# Altium project waku-ctl-board.PrjPcb (part 2 of 5)
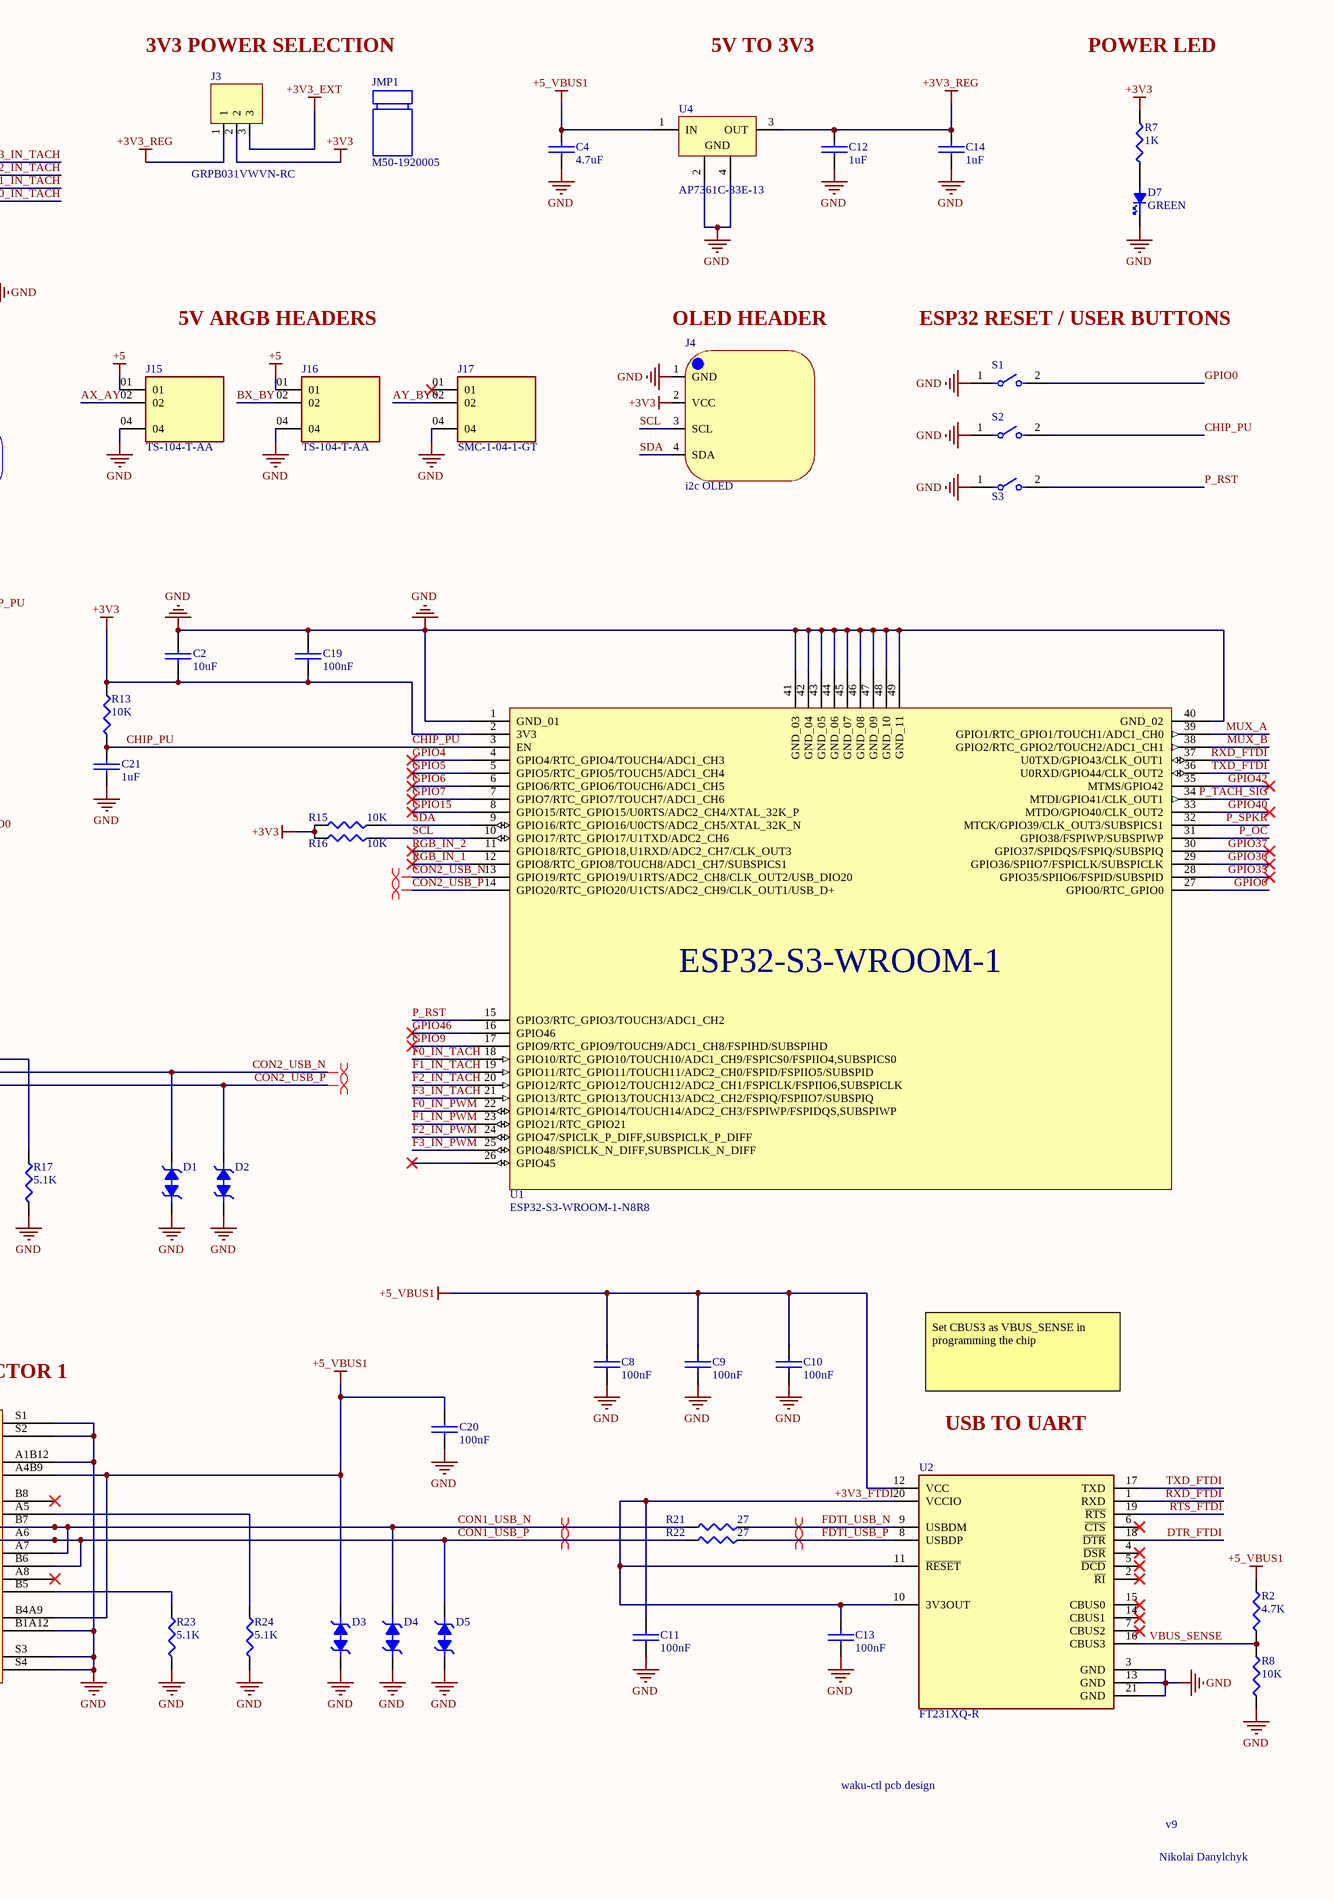
[diagram p2: waku-ctl.SchDoc, right]

## Sheet waku-ctl.SchDoc (continued)
### Library data of the parts
C1 C3 C5-C11 C13 C19 C20 = CL10B104KB8NNNC: CAP CER 0.1UF 50V X7R 0603; Manufacturer: Samsung Electro-Mechanics; Dielectric Material: Ceramic; Tolerance: 10%; Supplier: DigiKey; Supplier Part Number: 1276-1000-6-ND; Manufacturer Part Number: CL10B104KB8NNNC; RoHS: Compliant; Category: Ceramic Capacitors; Stock: 3849290; Pricing: 1=0.08, 10=0.004 (USD); Value: 100nF; Case/Package: 0603; Case Code (Imperial): 0603; Case Code (Metric): 1608; China RoHS: Compliant; Contact Plating: Tin; Depth: 800µm; Dielectric: X7R; Height: 900µm; Lead Free: Lead Free; Length: 1.6mm; Lifecycle Status: Production; Material: Ceramic; Max Operating Temperature: 125°C; Min Operating Temperature: -55°C; Mounting Technology: Surface Mount; Number of Terminals: 2; Radiation Hardening: No; REACH SVHC: Yes; Schedule B: 8532240020, 8532240020|8532240020|8532240020|8532240020|8532240020|8532240020|8532240020|8532240020|8532240020|8532240020, 8532240020|8532240020|8532240020|8532240020|8532240020|8532240020|8532240020|8532240020|8532240020|8532240020|8532240020, 8532240020|8532240020|8532240020|8532240020|8532240020|8532240020|8532240020|8532240020|8532240020|8532240020|8532240020|8532240020; Thickness: 889µm; Voltage: 50V; Voltage Rating: 50V; Voltage Rating (DC): 50V; Width: 800µm; ComponentLink1URL: https://datasheet.octopart.com:443/CL10B104KB8NNNC-Samsung-datasheet-165517828.pdf?src-supplier=Upverter; ComponentLink1Description: https://datasheet.octopart.com:443/CL10B104KB8NNNC-Samsung-datasheet-165517828.pdf?src-supplier=Upverter; ComponentLink2URL: https://datasheet.octopart.com:443/CL10B104KB8NNNC-Samsung-Electro-Mechanics-datasheet-116890969.pdf?src-supplier=Upverter; ComponentLink2Description: https://datasheet.octopart.com:443/CL10B104KB8NNNC-Samsung-Electro-Mechanics-datasheet-116890969.pdf?src-supplier=Upverter; ComponentLink3URL: https://datasheet.octopart.com:443/CL10B104KB8NNNC-Samsung-Electro-Mechanics-datasheet-81461840.pdf?src-supplier=Upverter; ComponentLink3Description: https://datasheet.octopart.com:443/CL10B104KB8NNNC-Samsung-Electro-Mechanics-datasheet-81461840.pdf?src-supplier=Upverter; ComponentLink4URL: https://datasheet.octopart.com:443/CL10B104KB8NNNC-Samsung-Electro-Mechanics-datasheet-181551448.pdf?src-supplier=Newark; ComponentLink4Description: https://datasheet.octopart.com:443/CL10B104KB8NNNC-Samsung-Electro-Mechanics-datasheet-181551448.pdf?src-supplier=Newark; ComponentLink5URL: https://datasheet.octopart.com:443/CL10B104KB8NNNC-Samsung-Electro-Mechanics-datasheet-181551449.pdf?src-supplier=Newark; ComponentLink5Description: https://datasheet.octopart.com:443/CL10B104KB8NNNC-Samsung-Electro-Mechanics-datasheet-181551449.pdf?src-supplier=Newark; ComponentLink6URL: https://datasheet.octopart.com/CL10B104KB8NNNC-Samsung-Electro-Mechanics-datasheet-8324245.pdf; ComponentLink6Description: https://datasheet.octopart.com/CL10B104KB8NNNC-Samsung-Electro-Mechanics-datasheet-8324245.pdf; ComponentLink7URL: https://datasheet.octopart.com/CL10B104KB8NNNC-Samsung-Electro-Mechanics-datasheet-97040617.pdf; ComponentLink7Description: https://datasheet.octopart.com/CL10B104KB8NNNC-Samsung-Electro-Mechanics-datasheet-97040617.pdf; ComponentLink8URL: https://datasheet.octopart.com/General-Multilayer-Ceramic-Capacitors-Samsung-datasheet-family-111.pdf; ComponentLink8Description: https://datasheet.octopart.com/General-Multilayer-Ceramic-Capacitors-Samsung-datasheet-family-111.pdf; ComponentLink9URL: https://datasheet.octopart.com:443/CL10B104KB8NNNC-Samsung-Electro-Mechanics-datasheet-136482302.pdf?src-supplier=Samsung+SCT; ComponentLink9Description: https://datasheet.octopart.com:443/CL10B104KB8NNNC-Samsung-Electro-Mechanics-datasheet-136482302.pdf?src-supplier=Samsung+SCT; ComponentLink10URL: https://datasheet.octopart.com:443/CL10B104KB8NNNC-Samsung-datasheet-42770373.pdf?src-supplier=Future+Electronics; ComponentLink10Description: https://datasheet.octopart.com:443/CL10B104KB8NNNC-Samsung-datasheet-42770373.pdf?src-supplier=Future+Electronics; ComponentLink11URL: https://datasheet.octopart.com:443/CL10B104KB8NNNC-Samsung-datasheet-26589154.pdf?src-supplier=Future+Electronics; ComponentLink11Description: https://datasheet.octopart.com:443/CL10B104KB8NNNC-Samsung-datasheet-26589154.pdf?src-supplier=Future+Electronics; ComponentLink12URL: https://datasheet.octopart.com:443/CL10B104KB8NNNC-Samsung-Electro-Mechanics-datasheet-149136784.pdf?src-supplier=Future+Electronics; ComponentLink12Description: https://datasheet.octopart.com:443/CL10B104KB8NNNC-Samsung-Electro-Mechanics-datasheet-149136784.pdf?src-supplier=Future+Electronics; ComponentLink13URL: https://datasheet.octopart.com:443/CL10B104KB8NNNC-Samsung-datasheet-22147433.pdf?src-supplier=TME; ComponentLink13Description: https://datasheet.octopart.com:443/CL10B104KB8NNNC-Samsung-datasheet-22147433.pdf?src-supplier=TME; ComponentLink14URL: https://datasheet.octopart.com:443/CL10B104KB8NNNC-Samsung-Electro-Mechanics-datasheet-11837008.pdf?src-supplier=Arrow+Electronics; ComponentLink14Description: https://datasheet.octopart.com:443/CL10B104KB8NNNC-Samsung-Electro-Mechanics-datasheet-11837008.pdf?src-supplier=Arrow+Electronics; ComponentLink15URL: http://sigma.octopart.com:80/rohs_certificate/General-Multilayer-Ceramic-Capacitors-Samsung-family-110.pdf?src-supplier=Compliance+Statements; ComponentLink15Description: http://sigma.octopart.com:80/rohs_certificate/General-Multilayer-Ceramic-Capacitors-Samsung-family-110.pdf?src-supplier=Compliance+Statements; ComponentLink16URL: http://sigma.octopart.com:80/rohs_statement/General-Multilayer-Ceramic-Capacitors-Samsung-family-132.pdf?src-supplier=Compliance+Statements; ComponentLink16Description: http://sigma.octopart.com:80/rohs_statement/General-Multilayer-Ceramic-Capacitors-Samsung-family-132.pdf?src-supplier=Compliance+Statements; ComponentLink17URL: http://sigma.octopart.com:80/reach_statement/General-Multilayer-Ceramic-Capacitors-Samsung-family-133.pdf?src-supplier=Compliance+Statements; ComponentLink17Description: http://sigma.octopart.com:80/reach_statement/General-Multilayer-Ceramic-Capacitors-Samsung-family-133.pdf?src-supplier=Compliance+Statements; LCSC Part Number: C1591
C2 = CL10A106KP8NNNC: CAP CER 10UF 10V X5R 0603; Manufacturer: Samsung Electro-Mechanics; Value: 10µF; Dielectric Material: Ceramic; Tolerance: 10%; Supplier: DigiKey; Supplier Part Number: 1276-1192-6-ND; Manufacturer Part Number: CL10A106KP8NNNC; RoHS: Compliant; Category: Ceramic Capacitors; Stock: 1052975; Pricing: 1=0.08, 10=0.022 (USD); Case/Package: 0603; Case Code (Imperial): 0603; Case Code (Metric): 1608; China RoHS: Compliant; Contact Plating: Tin; Depth: 800µm; Dielectric: X5R; Height: 800µm; Lead Free: Lead Free; Length: 1.6mm; Lifecycle Status: Production; Material: Ceramic; Max Operating Temperature: 85°C; Min Operating Temperature: -55°C; Mounting Technology: Surface Mount; Number of Terminals: 2; Radiation Hardening: No; REACH SVHC: Yes; Schedule B: 8532240020, 8532240020|8532240020|8532240020|8532240020|8532240020|8532240020|8532240020|8532240020|8532240020|8532240020|8532240020|8532240020|8532240020|8532240020|8532240020|8532240020|8532240020|8532240020|8532240020|8532240020|8532240020|8532240020|8532240020|85; Thickness: 889µm; Voltage Rating: 10V; Voltage Rating (DC): 10V; Width: 800µm; ComponentLink1URL: https://datasheet.octopart.com:443/CL10A106KP8NNNC-Samsung-Electro-Mechanics-datasheet-181960519.pdf?src-supplier=IHS; ComponentLink1Description: https://datasheet.octopart.com:443/CL10A106KP8NNNC-Samsung-Electro-Mechanics-datasheet-181960519.pdf?src-supplier=IHS; ComponentLink2URL: https://datasheet.octopart.com/CL10A106KP8NNNC-Samsung-Electro-Mechanics-datasheet-8324245.pdf; ComponentLink2Description: https://datasheet.octopart.com/CL10A106KP8NNNC-Samsung-Electro-Mechanics-datasheet-8324245.pdf; ComponentLink3URL: https://datasheet.octopart.com/CL10A106KP8NNNC-Samsung-Electro-Mechanics-datasheet-97040617.pdf; ComponentLink3Description: https://datasheet.octopart.com/CL10A106KP8NNNC-Samsung-Electro-Mechanics-datasheet-97040617.pdf; ComponentLink4URL: https://datasheet.octopart.com:443/CL10A106KP8NNNC-Samsung-Electro-Mechanics-datasheet-136031754.pdf?src-supplier=Future+Electronics; ComponentLink4Description: https://datasheet.octopart.com:443/CL10A106KP8NNNC-Samsung-Electro-Mechanics-datasheet-136031754.pdf?src-supplier=Future+Electronics; ComponentLink5URL: https://datasheet.octopart.com:443/CL10A106KP8NNNC-Samsung-Electro-Mechanics-datasheet-110226289.pdf?src-supplier=Future+Electronics; ComponentLink5Description: https://datasheet.octopart.com:443/CL10A106KP8NNNC-Samsung-Electro-Mechanics-datasheet-110226289.pdf?src-supplier=Future+Electronics; ComponentLink6URL: https://datasheet.octopart.com:443/CL10A106KP8NNNC-Samsung-Electro-Mechanics-datasheet-81461787.pdf?src-supplier=Future+Electronics; ComponentLink6Description: https://datasheet.octopart.com:443/CL10A106KP8NNNC-Samsung-Electro-Mechanics-datasheet-81461787.pdf?src-supplier=Future+Electronics; ComponentLink7URL: https://datasheet.octopart.com:443/CL10A106KP8NNNC-Samsung-datasheet-48647232.pdf?src-supplier=Future+Electronics; ComponentLink7Description: https://datasheet.octopart.com:443/CL10A106KP8NNNC-Samsung-datasheet-48647232.pdf?src-supplier=Future+Electronics; ComponentLink8URL: https://datasheet.octopart.com:443/CL10A106KP8NNNC-Samsung-datasheet-34157262.pdf?src-supplier=Future+Electronics; ComponentLink8Description: https://datasheet.octopart.com:443/CL10A106KP8NNNC-Samsung-datasheet-34157262.pdf?src-supplier=Future+Electronics; ComponentLink9URL: https://datasheet.octopart.com:443/CL10A106KP8NNNC-Samsung-datasheet-26589120.pdf?src-supplier=Future+Electronics; ComponentLink9Description: https://datasheet.octopart.com:443/CL10A106KP8NNNC-Samsung-datasheet-26589120.pdf?src-supplier=Future+Electronics; ComponentLink10URL: https://datasheet.octopart.com:443/CL10A106KP8NNNC-Samsung-Electro-Mechanics-datasheet-149156481.pdf?src-supplier=Future+Electronics; ComponentLink10Description: https://datasheet.octopart.com:443/CL10A106KP8NNNC-Samsung-Electro-Mechanics-datasheet-149156481.pdf?src-supplier=Future+Electronics; ComponentLink11URL: https://datasheet.octopart.com:443/CL10A106KP8NNNC-Samsung-Electro-Mechanics-datasheet-11968064.pdf?src-supplier=Arrow+Electronics; ComponentLink11Description: https://datasheet.octopart.com:443/CL10A106KP8NNNC-Samsung-Electro-Mechanics-datasheet-11968064.pdf?src-supplier=Arrow+Electronics; ComponentLink12URL: https://datasheet.octopart.com:443/CL10A106KP8NNNC-Samsung-datasheet-8326407.pdf?src-supplier=TME; ComponentLink12Description: https://datasheet.octopart.com:443/CL10A106KP8NNNC-Samsung-datasheet-8326407.pdf?src-supplier=TME; LCSC Part Number: C19702
C4 = CL10A475KP8NNNC: CAP CER 4.7UF 10V X5R 0603; Manufacturer: Samsung Electro-Mechanics; Value: 4.7µF; Dielectric Material: Ceramic; Tolerance: 10%; Supplier: DigiKey; Supplier Part Number: 1276-1044-1-ND; Manufacturer Part Number: CL10A475KP8NNNC; RoHS: Compliant; Category: Ceramic Capacitors; Stock: 4003618; Pricing: 1=0.08, 10=0.006 (USD); Case/Package: 0603; Case Code (Imperial): 0603; Case Code (Metric): 1608; China RoHS: Compliant; Contact Plating: Tin; Depth: 800µm; Dielectric: X5R; Height: 800µm; Length: 1.6mm; Lifecycle Status: Production; Material: Ceramic; Max Operating Temperature: 85°C; Min Operating Temperature: -55°C; Mounting Technology: Surface Mount; Number of Terminals: 2; Radiation Hardening: No; REACH SVHC: Yes; Schedule B: 8532240020, 8532240020|8532240020|8532240020|8532240020|8532240020|8532240020|8532240020|8532240020|8532240020|8532240020|8532240020|8532240020|8532240020|8532240020|8532240020|8532240020|8532240020|8532240020|8532240020|8532240020|8532240020|8532240020|8532240020|85; Thickness: 889µm; Voltage Rating: 10V; Voltage Rating (DC): 10V; Width: 800µm; ComponentLink1URL: https://datasheet.octopart.com:443/CL10A475KP8NNNC-Samsung-Electro-Mechanics-datasheet-141347107.pdf?src-supplier=IHS; ComponentLink1Description: https://datasheet.octopart.com:443/CL10A475KP8NNNC-Samsung-Electro-Mechanics-datasheet-141347107.pdf?src-supplier=IHS; ComponentLink2URL: https://datasheet.octopart.com/CL10A475KP8NNNC-Samsung-Electro-Mechanics-datasheet-8324245.pdf; ComponentLink2Description: https://datasheet.octopart.com/CL10A475KP8NNNC-Samsung-Electro-Mechanics-datasheet-8324245.pdf; ComponentLink3URL: https://datasheet.octopart.com/CL10A475KP8NNNC-Samsung-Electro-Mechanics-datasheet-97040617.pdf; ComponentLink3Description: https://datasheet.octopart.com/CL10A475KP8NNNC-Samsung-Electro-Mechanics-datasheet-97040617.pdf; ComponentLink4URL: https://datasheet.octopart.com/General-Multilayer-Ceramic-Capacitors-Samsung-datasheet-family-111.pdf; ComponentLink4Description: https://datasheet.octopart.com/General-Multilayer-Ceramic-Capacitors-Samsung-datasheet-family-111.pdf; ComponentLink5URL: https://datasheet.octopart.com:443/CL10A475KP8NNNC-Samsung-Electro-Mechanics-datasheet-110226306.pdf?src-supplier=Future+Electronics; ComponentLink5Description: https://datasheet.octopart.com:443/CL10A475KP8NNNC-Samsung-Electro-Mechanics-datasheet-110226306.pdf?src-supplier=Future+Electronics; ComponentLink6URL: https://datasheet.octopart.com:443/CL10A475KP8NNNC-Samsung-Electro-Mechanics-datasheet-81461812.pdf?src-supplier=Future+Electronics; ComponentLink6Description: https://datasheet.octopart.com:443/CL10A475KP8NNNC-Samsung-Electro-Mechanics-datasheet-81461812.pdf?src-supplier=Future+Electronics; ComponentLink7URL: https://datasheet.octopart.com:443/CL10A475KP8NNNC-Samsung-datasheet-44382860.pdf?src-supplier=Future+Electronics; ComponentLink7Description: https://datasheet.octopart.com:443/CL10A475KP8NNNC-Samsung-datasheet-44382860.pdf?src-supplier=Future+Electronics; ComponentLink8URL: https://datasheet.octopart.com:443/CL10A475KP8NNNC-Samsung-datasheet-26589134.pdf?src-supplier=Future+Electronics; ComponentLink8Description: https://datasheet.octopart.com:443/CL10A475KP8NNNC-Samsung-datasheet-26589134.pdf?src-supplier=Future+Electronics; ComponentLink9URL: https://datasheet.octopart.com:443/CL10A475KP8NNNC-Samsung-Electro-Mechanics-datasheet-149158807.pdf?src-supplier=Future+Electronics; ComponentLink9Description: https://datasheet.octopart.com:443/CL10A475KP8NNNC-Samsung-Electro-Mechanics-datasheet-149158807.pdf?src-supplier=Future+Electronics; ComponentLink10URL: https://datasheet.octopart.com:443/CL10A475KP8NNNC-Samsung-datasheet-59220082.pdf?src-supplier=TME; ComponentLink10Description: https://datasheet.octopart.com:443/CL10A475KP8NNNC-Samsung-datasheet-59220082.pdf?src-supplier=TME; ComponentLink11URL: https://datasheet.octopart.com:443/CL10A475KP8NNNC-Samsung-Electro-Mechanics-datasheet-11791968.pdf?src-supplier=Arrow+Electronics; ComponentLink11Description: https://datasheet.octopart.com:443/CL10A475KP8NNNC-Samsung-Electro-Mechanics-datasheet-11791968.pdf?src-supplier=Arrow+Electronics; ComponentLink12URL: http://sigma.octopart.com:80/rohs_certificate/General-Multilayer-Ceramic-Capacitors-Samsung-family-110.pdf?src-supplier=Compliance+Statements; ComponentLink12Description: http://sigma.octopart.com:80/rohs_certificate/General-Multilayer-Ceramic-Capacitors-Samsung-family-110.pdf?src-supplier=Compliance+Statements; ComponentLink13URL: http://sigma.octopart.com:80/rohs_statement/General-Multilayer-Ceramic-Capacitors-Samsung-family-132.pdf?src-supplier=Compliance+Statements; ComponentLink13Description: http://sigma.octopart.com:80/rohs_statement/General-Multilayer-Ceramic-Capacitors-Samsung-family-132.pdf?src-supplier=Compliance+Statements; ComponentLink14URL: http://sigma.octopart.com:80/reach_statement/General-Multilayer-Ceramic-Capacitors-Samsung-family-133.pdf?src-supplier=Compliance+Statements; ComponentLink14Description: http://sigma.octopart.com:80/reach_statement/General-Multilayer-Ceramic-Capacitors-Samsung-family-133.pdf?src-supplier=Compliance+Statements; LCSC Part Number: C1705
C12 C14 C21 = CL10A105KA8NNNC: CAP CER 1UF 25V X5R 0603; Manufacturer: Samsung Electro-Mechanics; Value: 1µF; Dielectric Material: Ceramic; Tolerance: 10%; Supplier: DigiKey; Supplier Part Number: 1276-1102-6-ND; Manufacturer Part Number: CL10A105KA8NNNC; RoHS: Compliant; Category: Ceramic Capacitors; Stock: 788704; Pricing: 1=0.08, 10=0.005, 50=0.0044, 100=0.0043 (USD); Case/Package: 0603; Case Code (Imperial): 0603; Case Code (Metric): 1608; China RoHS: Compliant; Contact Plating: Tin; Depth: 800µm; Dielectric: X5R; Height: 800µm; Lead Free: Lead Free; Length: 1.6mm; Lifecycle Status: Production; Material: Ceramic; Max Operating Temperature: 85°C; Min Operating Temperature: -55°C; Mounting Technology: Surface Mount; Number of Terminals: 2; Radiation Hardening: No; REACH SVHC: Yes; Schedule B: 8532240020, 8532240020|8532240020|8532240020|8532240020|8532240020|8532240020|8532240020|8532240020|8532240020|8532240020|8532240020|8532240020|8532240020|8532240020|8532240020|8532240020|8532240020|8532240020|8532240020|8532240020|8532240020|8532240020|8532240020|85; Thickness: 889µm; Voltage: 25V; Voltage Rating: 25V; Voltage Rating (DC): 25V; Width: 800µm; ComponentLink1URL: https://datasheet.octopart.com:443/CL10A105KA8NNNC-Samsung-Electro-Mechanics-datasheet-136031742.pdf?src-supplier=IHS; ComponentLink1Description: https://datasheet.octopart.com:443/CL10A105KA8NNNC-Samsung-Electro-Mechanics-datasheet-136031742.pdf?src-supplier=IHS; ComponentLink2URL: https://datasheet.octopart.com:443/CL10A105KA8NNNC-Samsung-datasheet-8328790.pdf?src-supplier=TME; ComponentLink2Description: https://datasheet.octopart.com:443/CL10A105KA8NNNC-Samsung-datasheet-8328790.pdf?src-supplier=TME; ComponentLink3URL: https://datasheet.octopart.com:443/CL10A105KA8NNNC-Samsung-datasheet-22147431.pdf?src-supplier=TME; ComponentLink3Description: https://datasheet.octopart.com:443/CL10A105KA8NNNC-Samsung-datasheet-22147431.pdf?src-supplier=TME; ComponentLink4URL: https://datasheet.octopart.com:443/CL10A105KA8NNNC-Samsung-Electro-Mechanics-datasheet-110326820.pdf?src-supplier=Future+Electronics; ComponentLink4Description: https://datasheet.octopart.com:443/CL10A105KA8NNNC-Samsung-Electro-Mechanics-datasheet-110326820.pdf?src-supplier=Future+Electronics; ComponentLink5URL: https://datasheet.octopart.com:443/CL10A105KA8NNNC-Samsung-Electro-Mechanics-datasheet-81461776.pdf?src-supplier=Future+Electronics; ComponentLink5Description: https://datasheet.octopart.com:443/CL10A105KA8NNNC-Samsung-Electro-Mechanics-datasheet-81461776.pdf?src-supplier=Future+Electronics; ComponentLink6URL: https://datasheet.octopart.com:443/CL10A105KA8NNNC-Samsung-datasheet-42485231.pdf?src-supplier=Future+Electronics; ComponentLink6Description: https://datasheet.octopart.com:443/CL10A105KA8NNNC-Samsung-datasheet-42485231.pdf?src-supplier=Future+Electronics; ComponentLink7URL: https://datasheet.octopart.com:443/CL10A105KA8NNNC-Samsung-datasheet-26589109.pdf?src-supplier=Future+Electronics; ComponentLink7Description: https://datasheet.octopart.com:443/CL10A105KA8NNNC-Samsung-datasheet-26589109.pdf?src-supplier=Future+Electronics; ComponentLink8URL: https://datasheet.octopart.com:443/CL10A105KA8NNNC-Samsung-Electro-Mechanics-datasheet-149156475.pdf?src-supplier=Future+Electronics; ComponentLink8Description: https://datasheet.octopart.com:443/CL10A105KA8NNNC-Samsung-Electro-Mechanics-datasheet-149156475.pdf?src-supplier=Future+Electronics; ComponentLink9URL: https://datasheet.octopart.com/CL10A105KA8NNNC-Samsung-Electro-Mechanics-datasheet-97040617.pdf; ComponentLink9Description: https://datasheet.octopart.com/CL10A105KA8NNNC-Samsung-Electro-Mechanics-datasheet-97040617.pdf; ComponentLink10URL: https://datasheet.octopart.com/CL10A105KA8NNNC-Samsung-Electro-Mechanics-datasheet-8324245.pdf; ComponentLink10Description: https://datasheet.octopart.com/CL10A105KA8NNNC-Samsung-Electro-Mechanics-datasheet-8324245.pdf; ComponentLink11URL: https://datasheet.octopart.com/General-Multilayer-Ceramic-Capacitors-Samsung-datasheet-family-111.pdf; ComponentLink11Description: https://datasheet.octopart.com/General-Multilayer-Ceramic-Capacitors-Samsung-datasheet-family-111.pdf; ComponentLink12URL: http://sigma.octopart.com:80/rohs_certificate/General-Multilayer-Ceramic-Capacitors-Samsung-family-110.pdf?src-supplier=Compliance+Statements; ComponentLink12Description: http://sigma.octopart.com:80/rohs_certificate/General-Multilayer-Ceramic-Capacitors-Samsung-family-110.pdf?src-supplier=Compliance+Statements; ComponentLink13URL: http://sigma.octopart.com:80/rohs_statement/General-Multilayer-Ceramic-Capacitors-Samsung-family-132.pdf?src-supplier=Compliance+Statements; ComponentLink13Description: http://sigma.octopart.com:80/rohs_statement/General-Multilayer-Ceramic-Capacitors-Samsung-family-132.pdf?src-supplier=Compliance+Statements; ComponentLink14URL: http://sigma.octopart.com:80/reach_statement/General-Multilayer-Ceramic-Capacitors-Samsung-family-133.pdf?src-supplier=Compliance+Statements; ComponentLink14Description: http://sigma.octopart.com:80/reach_statement/General-Multilayer-Ceramic-Capacitors-Samsung-family-133.pdf?src-supplier=Compliance+Statements; LCSC Part Number: C5673
C15-C18 = CL10B102KB85PNL: CAP CER 1nF 50V X7R 0603; Manufacturer: Samsung Electro-Mechanics; Dielectric Material: Ceramic; Tolerance: 10%; Supplier: DigiKey; Supplier Part Number: 1276-6991-1-ND; Manufacturer Part Number: CL10B102KB85PNL; RoHS: Compliant; Category: Ceramic Capacitors; Stock: 171523; Pricing: 1=0.09, 10=0.029, 50=0.09, 100=0.0165, 500=0.0118, 1000=0.01036, 2500=0.00884, 5000=0.00793 (EUR); Value: 1nF; Case/Package: 0603; China RoHS: Compliant; Depth: 800µm; Dielectric: X7R; Height: 800µm; Length: 1.6mm; Lifecycle Status: NRND; Material: Ceramic; Max Operating Temperature: 125°C; Min Operating Temperature: -55°C; Mounting Technology: Surface Mount; Number of Terminals: 2; Packaging: Tape and Reel; Radiation Hardening: No; REACH SVHC: Yes; Schedule B: 8532240020, 8532240020|8532240020|8532240020|8532240020|8532240020; Voltage Rating: 50V; Voltage Rating (DC): 50V; Width: 800µm; ComponentLink1URL: https://datasheet.octopart.com:443/CL10B102KB85PNL-Samsung-Electro-Mechanics-datasheet-140815171.pdf?src-supplier=IHS; ComponentLink1Description: https://datasheet.octopart.com:443/CL10B102KB85PNL-Samsung-Electro-Mechanics-datasheet-140815171.pdf?src-supplier=IHS; ComponentLink2URL: https://datasheet.octopart.com:443/CL10B102KB85PNL-Samsung-Electro-Mechanics-datasheet-176142735.pdf?src-supplier=Newark; ComponentLink2Description: https://datasheet.octopart.com:443/CL10B102KB85PNL-Samsung-Electro-Mechanics-datasheet-176142735.pdf?src-supplier=Newark; ComponentLink3URL: https://datasheet.octopart.com:443/CL10B102KB85PNL-Samsung-Electro-Mechanics-datasheet-11803267.pdf?src-supplier=Arrow+Electronics; ComponentLink3Description: https://datasheet.octopart.com:443/CL10B102KB85PNL-Samsung-Electro-Mechanics-datasheet-11803267.pdf?src-supplier=Arrow+Electronics; ComponentLink4URL: https://datasheet.octopart.com:443/CL10B102KB85PNL-Samsung-datasheet-59220082.pdf?src-supplier=TME; ComponentLink4Description: https://datasheet.octopart.com:443/CL10B102KB85PNL-Samsung-datasheet-59220082.pdf?src-supplier=TME; LCSC Part Number: C16194451
D1-D5 = SP3022-01ETG: TVS DIODE 5.3VWM 12VC SOD882; Manufacturer: Littelfuse; Clamping Voltage: 12V; Leakage Current: 100nA; Max Breakdown Voltage: 9V; Max Power Dissipation: 20W; Max Surge Current: 3A; Min Breakdown Voltage: 6.8V; Number of Bidirectional Channels: 1; Peak Pulse Current: 1A; Polarity: Bidirectional; Power Line Protection: No; Reverse Standoff Voltage: 5.3V; Supplier: DigiKey; Supplier Part Number: F6709CT-ND; Manufacturer Part Number: SP3022-01ETG; RoHS: Compliant; Category: TVS Diodes; Stock: 68383; Pricing: 1=0.15, 10=0.105 (EUR); Case/Package: SOD-882-2; Composition: Zener; Lifecycle Status: Production; Max Operating Temperature: 125°C; Min Operating Temperature: -40°C; Mounting Technology: Surface Mount; Number of Channels: 1; Number of Elements: 1; Pins: 2; Number of Terminals: 2; Peak Pulse Power: 20W; REACH SVHC: Yes; Termination: SMD/SMT; Working Voltage: 5.3V; ComponentLink1URL: https://datasheet.octopart.com:443/SP3022-01ETG-Littelfuse-datasheet-180609637.pdf?src-supplier=IHS; ComponentLink1Description: https://datasheet.octopart.com:443/SP3022-01ETG-Littelfuse-datasheet-180609637.pdf?src-supplier=IHS; ComponentLink2URL: https://datasheet.octopart.com:443/SP3022-01ETG-Littelfuse-datasheet-181956538.pdf?src-supplier=Newark; ComponentLink2Description: https://datasheet.octopart.com:443/SP3022-01ETG-Littelfuse-datasheet-181956538.pdf?src-supplier=Newark; ComponentLink3URL: https://datasheet.octopart.com:443/SP3022-01ETG-Littelfuse-datasheet-43876386.pdf?src-supplier=Newark; ComponentLink3Description: https://datasheet.octopart.com:443/SP3022-01ETG-Littelfuse-datasheet-43876386.pdf?src-supplier=Newark; ComponentLink4URL: https://datasheet.octopart.com:443/SP3022-01ETG-Littelfuse-datasheet-140480403.pdf?src-supplier=ODG+(Origin+Data+Global); ComponentLink4Description: https://datasheet.octopart.com:443/SP3022-01ETG-Littelfuse-datasheet-140480403.pdf?src-supplier=ODG+(Origin+Data+Global); ComponentLink5URL: https://datasheet.octopart.com:443/SP3022-01ETG-Littelfuse-datasheet-82968918.pdf?src-supplier=element14+APAC; ComponentLink5Description: https://datasheet.octopart.com:443/SP3022-01ETG-Littelfuse-datasheet-82968918.pdf?src-supplier=element14+APAC; ComponentLink6URL: https://datasheet.octopart.com:443/SP3022-01ETG-Littelfuse-datasheet-175469626.pdf?src-supplier=Future+Electronics; ComponentLink6Description: https://datasheet.octopart.com:443/SP3022-01ETG-Littelfuse-datasheet-175469626.pdf?src-supplier=Future+Electronics; ComponentLink7URL: https://datasheet.octopart.com:443/SP3022-01ETG-Littelfuse-datasheet-100434945.pdf?src-supplier=Future+Electronics; ComponentLink7Description: https://datasheet.octopart.com:443/SP3022-01ETG-Littelfuse-datasheet-100434945.pdf?src-supplier=Future+Electronics; Parameter 1: *; LCSC Part Number: C126840
D7 = VLMG1500-GS08: LED YLW-GRN 0402 SMD; Manufacturer: Vishay; Color: Green, Yellow; Dominant Wavelength: 571nm; Forward Current: 30mA; Forward Voltage: 2.4V; Lens Color: Clear; Lens Style: Rectangular; Luminous Intensity: 18mcd; Number of Circuits: 1; Power Dissipation: 75mW; Reverse Voltage: 5V; Test Current: 20mA; Viewing Angle: 130°; Supplier: DigiKey; Supplier Part Number: VLMG1500-GS08DKR-ND; Manufacturer Part Number: VLMG1500-GS08; RoHS: Compliant; Category: LEDs; Stock: 249321; Pricing: 1=0.2, 10=0.14, 100=0.2, 500=0.07856, 1000=0.07219 (EUR); Ambient Temperature Range High: 85°C; Case/Package: 0402; Case Code (Imperial): 0402; Case Code (Metric): 1005; Depth: 500µm; Height: 350µm; Illumination Color: Green; Lead Free: Lead Free; Length: 1mm; Lifecycle Status: Production; Max Operating Temperature: 85°C; Min Operating Temperature: -30°C; Mounting Technology: Surface Mount; Number of Elements: 1; Number of LEDs: 1; Pins: 2; Number of Terminals: 2; Packaging: Cut Tape; Peak Wavelength: 571nm; Power Rating: 75mW; Radiation Hardening: No; REACH SVHC: Yes; Schedule B: 8541402000, 8541402000|8541402000|8541402000|8541402000|8541402000; Shape: Rectangular; Terminal Pitch: 675µm; Wavelength: 571nm; Width: 500µm; ComponentLink1URL: https://datasheet.octopart.com:443/VLMG1500-GS08-Vishay-datasheet-181477802.pdf?src-supplier=IHS; ComponentLink1Description: https://datasheet.octopart.com:443/VLMG1500-GS08-Vishay-datasheet-181477802.pdf?src-supplier=IHS; ComponentLink2URL: https://datasheet.octopart.com:443/VLMG1500-GS08-Vishay-datasheet-21227148.pdf?src-supplier=element14+APAC; ComponentLink2Description: https://datasheet.octopart.com:443/VLMG1500-GS08-Vishay-datasheet-21227148.pdf?src-supplier=element14+APAC; ComponentLink3URL: https://datasheet.octopart.com:443/VLMG1500-GS08-Vishay-datasheet-33014519.pdf?src-supplier=element14+APAC; ComponentLink3Description: https://datasheet.octopart.com:443/VLMG1500-GS08-Vishay-datasheet-33014519.pdf?src-supplier=element14+APAC; ComponentLink4URL: https://datasheet.octopart.com:443/VLMG1500-GS08-Vishay-datasheet-62332426.pdf?src-supplier=Newark; ComponentLink4Description: https://datasheet.octopart.com:443/VLMG1500-GS08-Vishay-datasheet-62332426.pdf?src-supplier=Newark; ComponentLink5URL: https://datasheet.octopart.com:443/VLMG1500-GS08-Vishay-datasheet-102762782.pdf?src-supplier=Future+Electronics; ComponentLink5Description: https://datasheet.octopart.com:443/VLMG1500-GS08-Vishay-datasheet-102762782.pdf?src-supplier=Future+Electronics; ComponentLink6URL: https://datasheet.octopart.com:443/VLMG1500-GS08-Vishay-datasheet-68326145.pdf?src-supplier=TME; ComponentLink6Description: https://datasheet.octopart.com:443/VLMG1500-GS08-Vishay-datasheet-68326145.pdf?src-supplier=TME; ComponentLink7URL: http://sigma.octopart.com:80/rohs_statement/Vishay-company-15.pdf?src-supplier=Compliance+Statements; ComponentLink7Description: http://sigma.octopart.com:80/rohs_statement/Vishay-company-15.pdf?src-supplier=Compliance+Statements; LCSC Part Number: C511404
J1 J2 = 217179-0001: CONN RCP USB2.0 TYP C 24P SMD RA; Manufacturer: Molex; Contact Resistance: 50mΩ; Current Rating: 1.25A; Dielectric Material: Polyamide; Gender: Receptacle; Insulation Resistance: 100MΩ; Number of Contacts: 16; Number of Ports: 1; Voltage Rating: 30V; Supplier: DigiKey; Supplier Part Number: 900-2171790001CT-ND; Manufacturer Part Number: 217179-0001; RoHS: Compliant; Category: USB Connectors; Stock: 5092; Pricing: 1=0.83, 10=0.704, 25=0.6596, 50=0.628, 100=0.598, 250=0.56052, 500=0.53374, 1200=0.50175, 2400=0.4778, 3600=0.46433, 6000=0.4479, 8400=0.4374, 12000=0.42654 (USD); Contact Gender: Female; Contact Material: Gold, Nickel; Height: 3.36mm; Lifecycle Status: Production; Max Operating Temperature: 85°C; Min Operating Temperature: -40°C; Pins: 16; Number of Rows: 1; REACH SVHC: Yes; Shell Finish: Nickel; Shell Material: Stainless Steel; Terminal Pitch: 500µm; USB Standard: USB 2.0; ComponentLink1URL: https://datasheet.octopart.com:443/217179-0001-Molex-datasheet-158871109.pdf?src-supplier=ODG+(Origin+Data+Global); ComponentLink1Description: https://datasheet.octopart.com:443/217179-0001-Molex-datasheet-158871109.pdf?src-supplier=ODG+(Origin+Data+Global); ComponentLink2URL: https://sigma.octopart.com:443/158871110/technical_drawing/Molex-217179-0001.pdf?src-supplier=Upverter; ComponentLink2Description: https://sigma.octopart.com:443/158871110/technical_drawing/Molex-217179-0001.pdf?src-supplier=Upverter; ComponentLink3URL: https://datasheet.octopart.com:443/217179-0001-Molex-datasheet-164573281.pdf?src-supplier=RS+(Formerly+Allied+Electronics); ComponentLink3Description: https://datasheet.octopart.com:443/217179-0001-Molex-datasheet-164573281.pdf?src-supplier=RS+(Formerly+Allied+Electronics); ComponentLink4URL: http://sigma.octopart.com:80/conflict_mineral_statement/Molex-company-72.pdf?src-supplier=Compliance+Statements; ComponentLink4Description: http://sigma.octopart.com:80/conflict_mineral_statement/Molex-company-72.pdf?src-supplier=Compliance+Statements; ComponentLink5URL: http://sigma.octopart.com:80/rohs_statement/Molex-company-73.pdf?src-supplier=Compliance+Statements; ComponentLink5Description: http://sigma.octopart.com:80/rohs_statement/Molex-company-73.pdf?src-supplier=Compliance+Statements; ComponentLink6URL: http://sigma.octopart.com:80/reach_statement/Molex-company-74.pdf?src-supplier=Compliance+Statements; ComponentLink6Description: http://sigma.octopart.com:80/reach_statement/Molex-company-74.pdf?src-supplier=Compliance+Statements; LCSC Part Number: C3197684
J3 = GRPB031VWVN-RC: CONN HEADER VERT 3POS 1.27MM; Manufacturer: Sullins; Connector Type: Male Pin; Contact Resistance: 20mΩ; Current Rating: 1A; Dielectric Material: Polyamide; Insulation Resistance: 5GΩ; Number of Positions: 3; Supplier: DigiKey; Supplier Part Number: S9014E-03-ND; Manufacturer Part Number: GRPB031VWVN-RC; RoHS: Compliant; Category: Card Edge Connectors; Stock: 52349; Pricing: 1=0.19, 10=0.164, 100=0.1391, 500=0.12416, 1000=0.11822, 5000=0.10552, 10000=0.10048 (USD); Contact Gender: Male; Contact Mating Length: 2.9972mm; Contact Plating: Gold; Lead Free: Lead Free; Lifecycle Status: Production; Max Operating Temperature: 105°C; Min Operating Temperature: -40°C; Mounting Technology: Through Hole; Pins: 3; Number of Rows: 1; Packaging: Bulk; Pitch: 1.27mm; REACH SVHC: Yes; Terminal Pitch: 1.27mm; Termination: Solder; ComponentLink1URL: https://datasheet.octopart.com:443/GRPB031VWVN-RC-Sullins-datasheet-181250435.pdf?src-supplier=IHS; ComponentLink1Description: https://datasheet.octopart.com:443/GRPB031VWVN-RC-Sullins-datasheet-181250435.pdf?src-supplier=IHS; ComponentLink2URL: https://datasheet.octopart.com:443/GRPB031VWVN-RC-Sullins-datasheet-138898432.pdf?src-supplier=ODG+(Origin+Data+Global); ComponentLink2Description: https://datasheet.octopart.com:443/GRPB031VWVN-RC-Sullins-datasheet-138898432.pdf?src-supplier=ODG+(Origin+Data+Global); ComponentLink3URL: https://datasheet.octopart.com:443/GRPB031VWVN-RC-Sullins-datasheet-34148777.pdf?src-supplier=Future+Electronics; ComponentLink3Description: https://datasheet.octopart.com:443/GRPB031VWVN-RC-Sullins-datasheet-34148777.pdf?src-supplier=Future+Electronics; ComponentLink4URL: https://datasheet.octopart.com:443/GRPB031VWVN-RC-Sullins-datasheet-12514290.pdf?src-supplier=Future+Electronics; ComponentLink4Description: https://datasheet.octopart.com:443/GRPB031VWVN-RC-Sullins-datasheet-12514290.pdf?src-supplier=Future+Electronics; LCSC Part Number: C41427056
J4 = HS-HS96L03W2C03-OLED: HS HS96L03W2C03 i2c OLED screen
J5-J7 = 22-28-8020: CONN HEADER R/A 2POS 2.54MM; Manufacturer: Molex; Manufacturer Lifecycle Status: ACTIVE; Contact Resistance: 10mΩ; Current Rating: 4A; Gender: Male; Glow Wire Compliant: Non-compliant; Insulation Resistance: 1GΩ; Max Voltage Rating (DC): 250.25kV; Number of Circuits: 2; Operating Force: 4.8928N; Plating: Tin; Plating Thickness: 2.54µm; Voltage Rating: 500V; Voltage Rating (DC): 250V; Supplier: DigiKey; Supplier Part Number: WM50013-02-ND; Manufacturer Part Number: 22-28-8020; RoHS: Compliant; Category: Headers and Wire Housings; Stock: 771; Pricing: 1=0.38, 10=0.318, 100=0.38, 500=0.24124, 1000=0.22972, 5000=0.20505, 10000=0.19526 (EUR); China RoHS: Compliant; Color: Black; Contact Gender: Male; Contact Material: Nickel, Tin; Contact Plating: Tin; Country of Origin: US; Flammability Rating: UL94 V-0; Height: 2.74mm; Housing Color: Black; Housing Material: Thermoplastic; Lead Free: Lead Free; Lead Pitch: 2.54mm; Lifecycle Status: Production; Max Operating Temperature: 80°C; Min Operating Temperature: -40°C; Mounting Technology: Through Hole; Number of Contacts: 2; Pins: 2; Number of Positions: 2; Number of Rows: 1; Orientation: Right Angle; Packaging: Bulk; Pitch: 2.54mm; Radiation Hardening: No; REACH SVHC: Yes; Terminal Pitch: 2.54mm; Termination: Through Hole; ComponentLink1URL: https://datasheet.octopart.com:443/22-28-8020-Molex-datasheet-158885819.pdf?src-supplier=Newark; ComponentLink1Description: https://datasheet.octopart.com:443/22-28-8020-Molex-datasheet-158885819.pdf?src-supplier=Newark; ComponentLink2URL: https://datasheet.octopart.com:443/22-28-8020-Molex-datasheet-16301288.pdf?src-supplier=Molex; ComponentLink2Description: https://datasheet.octopart.com:443/22-28-8020-Molex-datasheet-16301288.pdf?src-supplier=Molex; ComponentLink3URL: https://sigma.octopart.com:443/12577388/technical_drawing/Molex-22-28-8020.pdf?src-supplier=Molex; ComponentLink3Description: https://sigma.octopart.com:443/12577388/technical_drawing/Molex-22-28-8020.pdf?src-supplier=Molex; ComponentLink4URL: https://datasheet.octopart.com:443/022288020-Molex-datasheet-8335722.pdf?src-supplier=Molex; ComponentLink4Description: https://datasheet.octopart.com:443/022288020-Molex-datasheet-8335722.pdf?src-supplier=Molex; ComponentLink5URL: https://datasheet.octopart.com:443/22-28-8020-Molex-datasheet-77519799.pdf?src-supplier=element14+APAC; ComponentLink5Description: https://datasheet.octopart.com:443/22-28-8020-Molex-datasheet-77519799.pdf?src-supplier=element14+APAC; ComponentLink6URL: https://datasheet.octopart.com:443/22-28-8020-Molex-datasheet-21206989.pdf?src-supplier=element14+APAC; ComponentLink6Description: https://datasheet.octopart.com:443/22-28-8020-Molex-datasheet-21206989.pdf?src-supplier=element14+APAC; ComponentLink7URL: https://datasheet.octopart.com:443/22-28-8020-Molex-datasheet-66628180.pdf?src-supplier=element14+APAC; ComponentLink7Description: https://datasheet.octopart.com:443/22-28-8020-Molex-datasheet-66628180.pdf?src-supplier=element14+APAC; ComponentLink8URL: https://datasheet.octopart.com:443/22-28-8020-Molex-datasheet-154747351.pdf?src-supplier=Master+Electronics; ComponentLink8Description: https://datasheet.octopart.com:443/22-28-8020-Molex-datasheet-154747351.pdf?src-supplier=Master+Electronics; ComponentLink9URL: https://datasheet.octopart.com:443/22-28-8020-Molex-datasheet-140181320.pdf?src-supplier=RS+(Formerly+Allied+Electronics); ComponentLink9Description: https://datasheet.octopart.com:443/22-28-8020-Molex-datasheet-140181320.pdf?src-supplier=RS+(Formerly+Allied+Electronics); ComponentLink10URL: https://datasheet.octopart.com:443/22-28-8020-Molex-datasheet-120146384.pdf?src-supplier=RS+(Formerly+Allied+Electronics); ComponentLink10Description: https://datasheet.octopart.com:443/22-28-8020-Molex-datasheet-120146384.pdf?src-supplier=RS+(Formerly+Allied+Electronics); ComponentLink11URL: https://datasheet.octopart.com:443/22-28-8020-Molex-datasheet-62280231.pdf?src-supplier=Electro+Sonic; ComponentLink11Description: https://datasheet.octopart.com:443/22-28-8020-Molex-datasheet-62280231.pdf?src-supplier=Electro+Sonic; ComponentLink12URL: https://datasheet.octopart.com:443/22-28-8020-Molex-datasheet-42201833.pdf?src-supplier=Electro+Sonic; ComponentLink12Description: https://datasheet.octopart.com:443/22-28-8020-Molex-datasheet-42201833.pdf?src-supplier=Electro+Sonic; ComponentLink13URL: https://datasheet.octopart.com:443/22-28-8020-Molex-datasheet-132467.pdf?src-supplier=DigiKey; ComponentLink13Description: https://datasheet.octopart.com:443/22-28-8020-Molex-datasheet-132467.pdf?src-supplier=DigiKey; ComponentLink14URL: http://sigma.octopart.com:80/16301292/rohs_statement/Molex-22-28-8020.pdf?src-supplier=Compliance+Statements; ComponentLink14Description: http://sigma.octopart.com:80/16301292/rohs_statement/Molex-22-28-8020.pdf?src-supplier=Compliance+Statements; ComponentLink15URL: http://sigma.octopart.com:80/conflict_mineral_statement/Molex-company-72.pdf?src-supplier=Compliance+Statements; ComponentLink15Description: http://sigma.octopart.com:80/conflict_mineral_statement/Molex-company-72.pdf?src-supplier=Compliance+Statements; ComponentLink16URL: http://sigma.octopart.com:80/rohs_statement/Molex-company-73.pdf?src-supplier=Compliance+Statements; ComponentLink16Description: http://sigma.octopart.com:80/rohs_statement/Molex-company-73.pdf?src-supplier=Compliance+Statements; ComponentLink17URL: http://sigma.octopart.com:80/reach_statement/Molex-company-74.pdf?src-supplier=Compliance+Statements; ComponentLink17Description: http://sigma.octopart.com:80/reach_statement/Molex-company-74.pdf?src-supplier=Compliance+Statements; LCSC Part Number: C225488
J8-J12 = 47053-1000: CONN HEADER VERT 4POS 2.54MM; Manufacturer: Molex; Manufacturer Lifecycle Status: ACTIVE; Current Rating: 500mA; Dielectric Material: Polyamide; Gender: Male; Glow Wire Compliant: Non-compliant; Number of Circuits: 2; Number of Contacts: 4; Operating Force: 1.946N; Plating: Copper; Plating Thickness: 2.54µm; Voltage Rating: 500V; Voltage Rating (DC): 250V; Supplier: DigiKey; Supplier Part Number: WM4330-ND; Manufacturer Part Number: 47053-1000; RoHS: Compliant; Category: Headers and Wire Housings; Stock: 47133; Pricing: 1=0.42, 10=0.354, 100=0.42, 500=0.26844, 1000=0.25562, 5000=0.22817, 10000=0.21729 (EUR); Ambient Temperature Range High: 105°C; China RoHS: Compliant; Contact Gender: Male; Contact Material: Brass; Contact Plating: Tin; Country of Origin: HK; Depth: 5.84mm; Halogen Free: Low Halogen; Height: 7.7mm; Housing Color: Beige; Housing Material: Nylon; Lead Pitch: 2.54mm; Length: 10.2mm; Lifecycle Status: Production; Max Operating Temperature: 75°C; Min Operating Temperature: -40°C; Mounting Technology: Through Hole; Pins: 4; Number of Positions: 4; Number of Rows: 1; Orientation: Vertical; Packaging: Bulk; Pitch: 2.54mm; Radiation Hardening: No; REACH SVHC: Yes; Schedule B: 8536694040, 8536694040|8536694040|8536694040|8536694040|8536694040|8536694040|8536694040|8536694040|8536694040|8536694040|8536694040|8536694040|8536694040|8536694040|8536694040|8536694040|8536694040|8536694040|8536694040|8536694040|8536694040|8536694040|8536694040|85; Terminal Pitch: 2.54mm; Termination: Through Hole; ComponentLink1URL: https://datasheet.octopart.com:443/47053-1000-Molex-datasheet-154585791.pdf?src-supplier=Sager+Electronics; ComponentLink1Description: https://datasheet.octopart.com:443/47053-1000-Molex-datasheet-154585791.pdf?src-supplier=Sager+Electronics; ComponentLink2URL: https://datasheet.octopart.com:443/47053-1000-Molex-datasheet-13792061.pdf?src-supplier=Sager+Electronics; ComponentLink2Description: https://datasheet.octopart.com:443/47053-1000-Molex-datasheet-13792061.pdf?src-supplier=Sager+Electronics; ComponentLink3URL: https://datasheet.octopart.com:443/0470531000-Molex-datasheet-157440094.pdf?src-supplier=Sager+Electronics; ComponentLink3Description: https://datasheet.octopart.com:443/0470531000-Molex-datasheet-157440094.pdf?src-supplier=Sager+Electronics; ComponentLink4URL: https://sigma.octopart.com:443/154585790/technical_drawing/Molex-47053-1000.pdf?src-supplier=Upverter; ComponentLink4Description: https://sigma.octopart.com:443/154585790/technical_drawing/Molex-47053-1000.pdf?src-supplier=Upverter; ComponentLink5URL: https://datasheet.octopart.com:443/47053-1000-Molex-datasheet-141422371.pdf?src-supplier=Upverter; ComponentLink5Description: https://datasheet.octopart.com:443/47053-1000-Molex-datasheet-141422371.pdf?src-supplier=Upverter; ComponentLink6URL: https://datasheet.octopart.com:443/47053-1000-Molex-datasheet-154585785.pdf?src-supplier=Upverter; ComponentLink6Description: https://datasheet.octopart.com:443/47053-1000-Molex-datasheet-154585785.pdf?src-supplier=Upverter; ComponentLink7URL: https://datasheet.octopart.com:443/47053-1000-Molex-datasheet-16078519.pdf?src-supplier=TME; ComponentLink7Description: https://datasheet.octopart.com:443/47053-1000-Molex-datasheet-16078519.pdf?src-supplier=TME; ComponentLink8URL: https://datasheet.octopart.com:443/470531000-Molex-datasheet-8344792.pdf?src-supplier=Molex; ComponentLink8Description: https://datasheet.octopart.com:443/470531000-Molex-datasheet-8344792.pdf?src-supplier=Molex; ComponentLink9URL: https://datasheet.octopart.com:443/47053-1000-Molex-datasheet-101583033.pdf?src-supplier=element14+APAC; ComponentLink9Description: https://datasheet.octopart.com:443/47053-1000-Molex-datasheet-101583033.pdf?src-supplier=element14+APAC; ComponentLink10URL: https://datasheet.octopart.com:443/47053-1000-Molex-datasheet-154752195.pdf?src-supplier=Master+Electronics; ComponentLink10Description: https://datasheet.octopart.com:443/47053-1000-Molex-datasheet-154752195.pdf?src-supplier=Master+Electronics; ComponentLink11URL: https://datasheet.octopart.com:443/47053-1000-Molex-datasheet-33003494.pdf?src-supplier=Electro+Sonic; ComponentLink11Description: https://datasheet.octopart.com:443/47053-1000-Molex-datasheet-33003494.pdf?src-supplier=Electro+Sonic; ComponentLink12URL: https://datasheet.octopart.com:443/47053-1000-Molex-datasheet-62104864.pdf?src-supplier=Electro+Sonic; ComponentLink12Description: https://datasheet.octopart.com:443/47053-1000-Molex-datasheet-62104864.pdf?src-supplier=Electro+Sonic; ComponentLink13URL: https://datasheet.octopart.com:443/47053-1000-Molex-datasheet-24932734.pdf?src-supplier=Electro+Sonic; ComponentLink13Description: https://datasheet.octopart.com:443/47053-1000-Molex-datasheet-24932734.pdf?src-supplier=Electro+Sonic; ComponentLink14URL: https://datasheet.octopart.com:443/47053-1000-Molex-datasheet-140185186.pdf?src-supplier=RS+(Formerly+Allied+Electronics); ComponentLink14Description: https://datasheet.octopart.com:443/47053-1000-Molex-datasheet-140185186.pdf?src-supplier=RS+(Formerly+Allied+Electronics); ComponentLink15URL: https://datasheet.octopart.com:443/47053-1000-Molex-datasheet-120151286.pdf?src-supplier=RS+(Formerly+Allied+Electronics); ComponentLink15Description: https://datasheet.octopart.com:443/47053-1000-Molex-datasheet-120151286.pdf?src-supplier=RS+(Formerly+Allied+Electronics); ComponentLink16URL: https://datasheet.octopart.com:443/47053-1000-Molex-datasheet-31972472.pdf?src-supplier=RS+(Formerly+Allied+Electronics); ComponentLink16Description: https://datasheet.octopart.com:443/47053-1000-Molex-datasheet-31972472.pdf?src-supplier=RS+(Formerly+Allied+Electronics); ComponentLink17URL: https://datasheet.octopart.com:443/47053-1000-Molex-datasheet-37247467.pdf?src-supplier=RS+(Formerly+Allied+Electronics); ComponentLink17Description: https://datasheet.octopart.com:443/47053-1000-Molex-datasheet-37247467.pdf?src-supplier=RS+(Formerly+Allied+Electronics); ComponentLink18URL: https://datasheet.octopart.com:443/470531000-Molex-datasheet-137316104.pdf?src-supplier=Future+Electronics; ComponentLink18Description: https://datasheet.octopart.com:443/470531000-Molex-datasheet-137316104.pdf?src-supplier=Future+Electronics; ComponentLink19URL: https://datasheet.octopart.com:443/47053-1000-Molex-datasheet-42575110.pdf?src-supplier=Farnell; ComponentLink19Description: https://datasheet.octopart.com:443/47053-1000-Molex-datasheet-42575110.pdf?src-supplier=Farnell; ComponentLink20URL: https://datasheet.octopart.com:443/470531000-Molex-datasheet-151821780.pdf?src-supplier=Toby+Electronics; ComponentLink20Description: https://datasheet.octopart.com:443/470531000-Molex-datasheet-151821780.pdf?src-supplier=Toby+Electronics; ComponentLink21URL: http://sigma.octopart.com:80/16397823/rohs_statement/Molex-47053-1000.pdf?src-supplier=Compliance+Statements; ComponentLink21Description: http://sigma.octopart.com:80/16397823/rohs_statement/Molex-47053-1000.pdf?src-supplier=Compliance+Statements; ComponentLink22URL: http://sigma.octopart.com:80/conflict_mineral_statement/Molex-company-72.pdf?src-supplier=Compliance+Statements; ComponentLink22Description: http://sigma.octopart.com:80/conflict_mineral_statement/Molex-company-72.pdf?src-supplier=Compliance+Statements; ComponentLink23URL: http://sigma.octopart.com:80/rohs_statement/Molex-company-73.pdf?src-supplier=Compliance+Statements; ComponentLink23Description: http://sigma.octopart.com:80/rohs_statement/Molex-company-73.pdf?src-supplier=Compliance+Statements; ComponentLink24URL: http://sigma.octopart.com:80/reach_statement/Molex-company-74.pdf?src-supplier=Compliance+Statements; ComponentLink24Description: http://sigma.octopart.com:80/reach_statement/Molex-company-74.pdf?src-supplier=Compliance+Statements; LCSC Part Number: C240840